# EAGLE design Prototype1 (EAGLE 7.5.0)
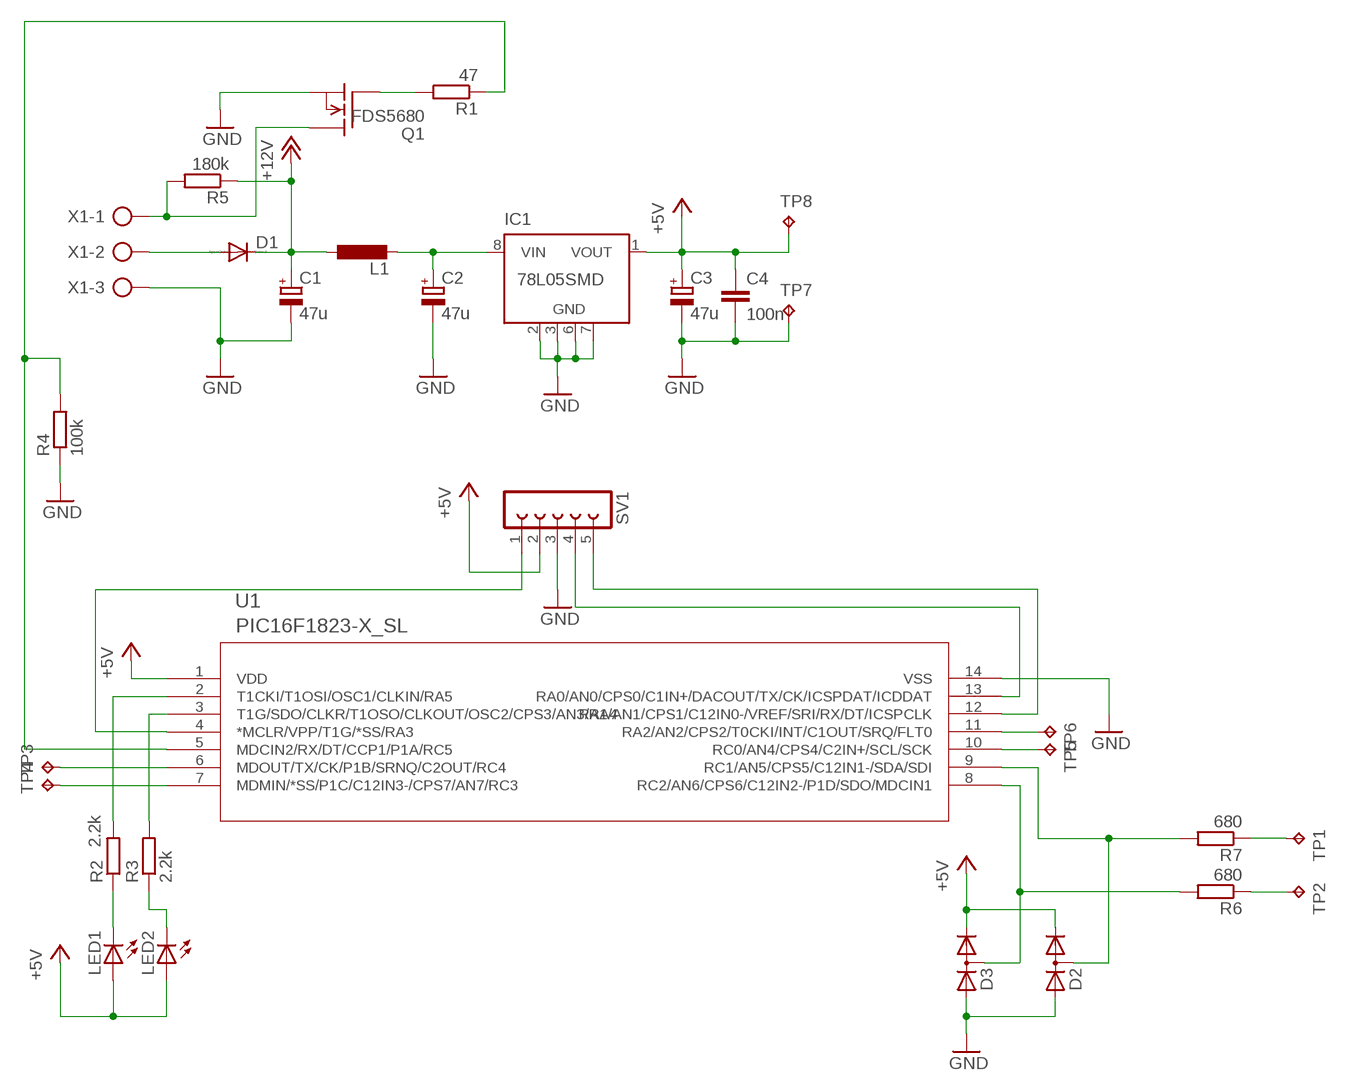
[diagram p0: schematic, sheet 1]

## Parts
C1  47u  CPOL-EU153CLV-0605  [153CLV-0605]
C2  47u  CPOL-EU153CLV-0605  [153CLV-0605]
C3  47u  CPOL-EU153CLV-0605  [153CLV-0605]
C4  100n  C-EUC0805  [C0805]
D1  DIODE-MELF-MLL41  [MELF-MLL41]
D2  DIODE_2CACA-SOT23  [SOT23]
D3  DIODE_2CACA-SOT23  [SOT23]
IC1  78L05SMD  [SO08]
L1  L-EUL3230M  [L3230M]
LED1  LEDSML1206  [SML1206]
LED2  LEDSML1206  [SML1206]
Q1  FDS5680  [SO-8]
R1  47  R-EU_M1206  [M1206]
R2  2.2k  R-EU_M1206  [M1206]
R3  2.2k  R-EU_M1206  [M1206]
R4  100k  R-EU_M1206  [M1206]
R5  180k  R-EU_M1206  [M1206]
R6  680  R-EU_M1206  [M1206]
R7  680  R-EU_M1206  [M1206]
SV1  FE05-1  [FE05-1]
TP1  TPPAD1-13Y  [P1-13Y]
TP2  TPPAD1-13Y  [P1-13Y]
TP3  TPB2,54  [B2,54]
TP4  TPB2,54  [B2,54]
TP5  TPB2,54  [B2,54]
TP6  TPB2,54  [B2,54]
TP7  TPB2,54  [B2,54]
TP8  TPB2,54  [B2,54]
U1  PIC16F1823-X_SL  [SOIC14-N_MC]
X1  AK500/3  [AK500/3]

## Nets
+5V: C3.+ C4.1 D2.2(C) D3.2(C) IC1.1(VOUT) LED1.A LED2.A SV1.2 TP8.TP U1.1(VDD)
+12V: C1.+ D1.C L1.1 R5.1
GND: C1.- C2.- C3.- C4.2 D2.1(A) D3.1(A) IC1.2(GND) IC1.3(GND) IC1.6(GND) IC1.7(GND) Q1.1(S) Q1.2(S) Q1.3(S) R4.1 SV1.3 TP7.TP U1.14(VSS) X1.3
N$1: D1.A X1.2
N$2: C2.+ IC1.8(VIN) L1.2
N$3: Q1.5(D) Q1.6(D) Q1.7(D) Q1.8(D) R5.2 X1.1
N$4: Q1.4(G) R1.2
N$5: D3.3(AC) R6.2 U1.8(RC2/AN6/CPS6/C12IN2-/P1D/SDO/MDCIN1)
N$6: D2.3(AC) R7.2 U1.9(RC1/AN5/CPS5/C12IN1-/SDA/SDI)
N$7: SV1.4 U1.13(RA0/AN0/CPS0/C1IN+/DACOUT/TX/CK/ICSPDAT/ICDDAT)
N$8: SV1.5 U1.12(RA1/AN1/CPS1/C12IN0-/VREF/SRI/RX/DT/ICSPCLK)
N$9: SV1.1 U1.4(*MCLR/VPP/T1G/*SS/RA3)
N$10: R1.1 R4.2 U1.5(MDCIN2/RX/DT/CCP1/P1A/RC5)
N$11: R7.1 TP1.TP
N$12: R6.1 TP2.TP
N$13: LED2.C R3.1
N$14: LED1.C R2.1
N$15: R3.2 U1.3(T1G/SDO/CLKR/T1OSO/CLKOUT/OSC2/CPS3/AN3/RA4)
N$16: R2.2 U1.2(T1CKI/T1OSI/OSC1/CLKIN/RA5)
N$17: TP3.TP U1.6(MDOUT/TX/CK/P1B/SRNQ/C2OUT/RC4)
N$18: TP4.TP U1.7(MDMIN/*SS/P1C/C12IN3-/CPS7/AN7/RC3)
N$19: TP5.TP U1.10(RC0/AN4/CPS4/C2IN+/SCL/SCK)
N$20: TP6.TP U1.11(RA2/AN2/CPS2/T0CKI/INT/C1OUT/SRQ/FLT0)
Unconnected: IC1.4(NC) IC1.5(NC)

## Library data of the parts
C1-C3 = rcl:CPOL-EU: POLARIZED CAPACITOR, European symbol
C4 = rcl:C-EU: CAPACITOR, European symbol
D1 = diode:DIODE-: DIODE
D2 D3 = diode:DIODE_2CACA-: 2 Diodes - Cathode-Anode|Cathode-Anode
IC1 = linear:78L*SMD: Positive VOLTAGE REGULATOR
L1 = rcl:L-EU: INDUCTOR, European symbol
LED1 LED2 = led:LED: LED OSRAM: - CHIPLED LG R971, LG N971, LY N971, LG Q971, LY Q971, LO R971, LY R971 LH N974, LH R974 LS Q976, LO Q976, LY Q976 LO Q996 - Hyper CHIPLED LW Q18S LB Q993, LB Q99A, LB R99A - SideLED LS A670, LO A670, LY A670, LG A670, LP A670 LB A673, LV A673, LT A673, LW A673 LH A674 LY A675 LS A676, LA A676, LO A676, LY A676, LW A676 LS A679, LY A679, LG A679 - Hyper Micro SIDELED® LS Y876, LA Y876, LO Y876, LY Y876 LT Y87S - SmartLED LW L88C, LW L88S LB L89C, LB L89S, LG L890 LS L89K, LO L89K, LY L89K LS L896, LA L896, LO L896, LY L896 - TOPLED LS T670, LO T670, LY T670, LG T670, LP T670 LSG T670, LSP T670, LSY T670, LOP T670, LYG T670 LG T671, LOG T671, LSG T671 LB T673, LV T673, LT T673, LW T673 LH T674 LS T676, LA T676, LO T676, LY T676, LB T676, LH T676, LSB T676, LW T676 LB T67C, LV T67C, LT T67C, LS T67K, LO T67K, LY T67K, LW E67C LS E67B, LA E67B, LO E67B, LY E67B, LB E67C, LV E67C, LT E67C LW T67C LS T679, LY T679, LG T679 LS T770, LO T770, LY T770, LG T770, LP T770 LB T773, LV T773, LT T773, LW T773 LH T774 LS E675, LA E675, LY E675, LS T675 LS T776, LA T776, LO T776, LY T776, LB T776 LHGB T686 LT T68C, LB T68C - Hyper Mini TOPLED® LB M676 - Mini TOPLED Santana® LG M470 LS M47K, LO M47K, LY M47K Source: http://www.osram.convergy.de LUXEON: - LUMILED® LXK2-PW12-R00, LXK2-PW12-S00, LXK2-PW14-U00, LXK2-PW14-V00 LXK2-PM12-R00, LXK2-PM12-S00, LXK2-PM14-U00 LXK2-PE12-Q00, LXK2-PE12-R00, LXK2-PE12-S00, LXK2-PE14-T00, LXK2-PE14-U00 LXK2-PB12-K00, LXK2-PB12-L00, LXK2-PB12-M00, LXK2-PB14-N00, LXK2-PB14-P00, LXK2-PB14-Q00 LXK2-PR12-L00, LXK2-PR12-M00, LXK2-PR14-Q00, LXK2-PR14-R00 LXK2-PD12-Q00, LXK2-PD12-R00, LXK2-PD12-S00 LXK2-PH12-R00, LXK2-PH12-S00 LXK2-PL12-P00, LXK2-PL12-Q00, LXK2-PL12-R00 Source: www.luxeon.com KINGBRIGHT: KA-3528ASYC Source: www.kingbright.com
Q1 = transistor-fet:FDS5680: 60V N-Channel PowerTrench TM MOSFET FAIRCHILD FDS5680.pdf
R1-R7 = rcl:R-EU_: RESISTOR, European symbol
SV1 = con-lsta:FE05-1: FEMALE HEADER; OC_FARNELL: unknown; OC_NEWARK: unknown
TP1-TP8 = testpad:TP: Test pad
U1 = microchip_pic16:PIC16F1823-X_SL
X1 = con-ptr500:AK500/3: CONNECTOR; OC_FARNELL: unknown; OC_NEWARK: unknown

## Board
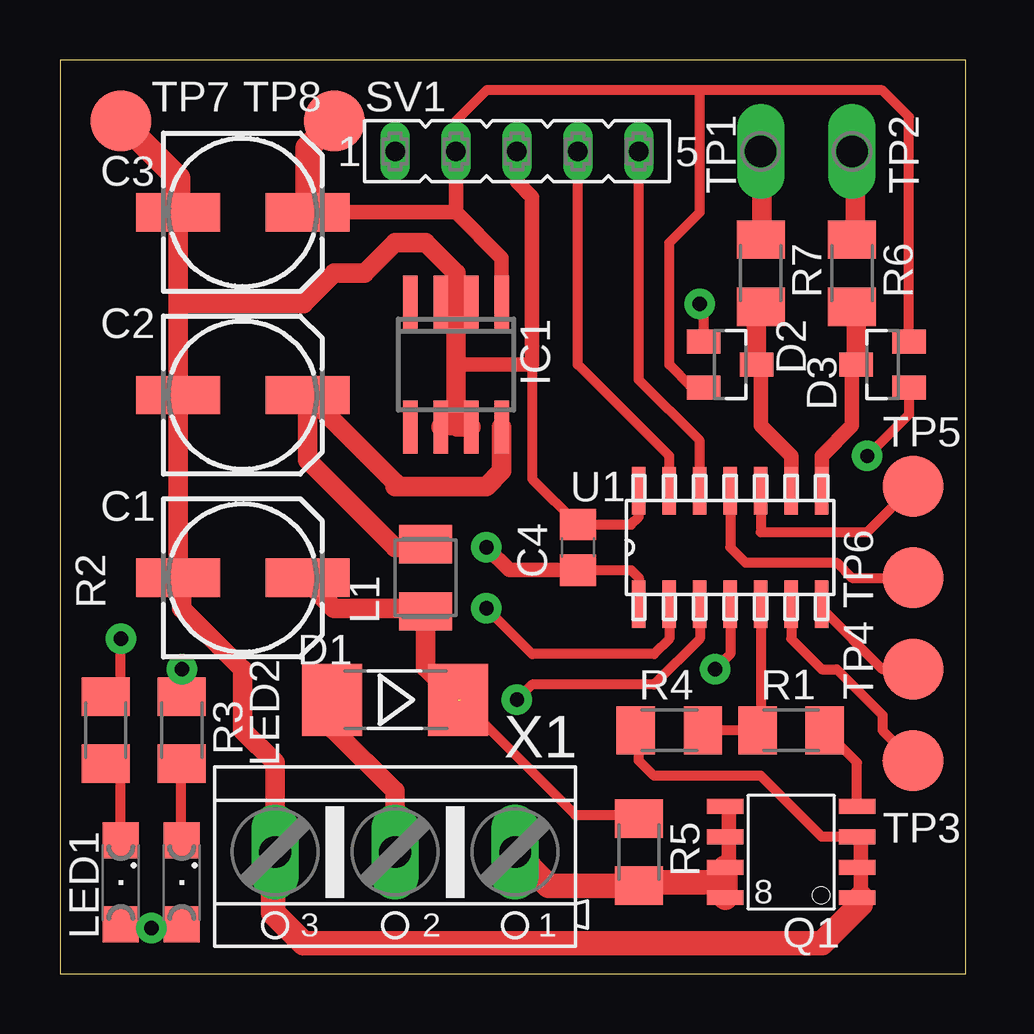
[diagram p1: board, top side]
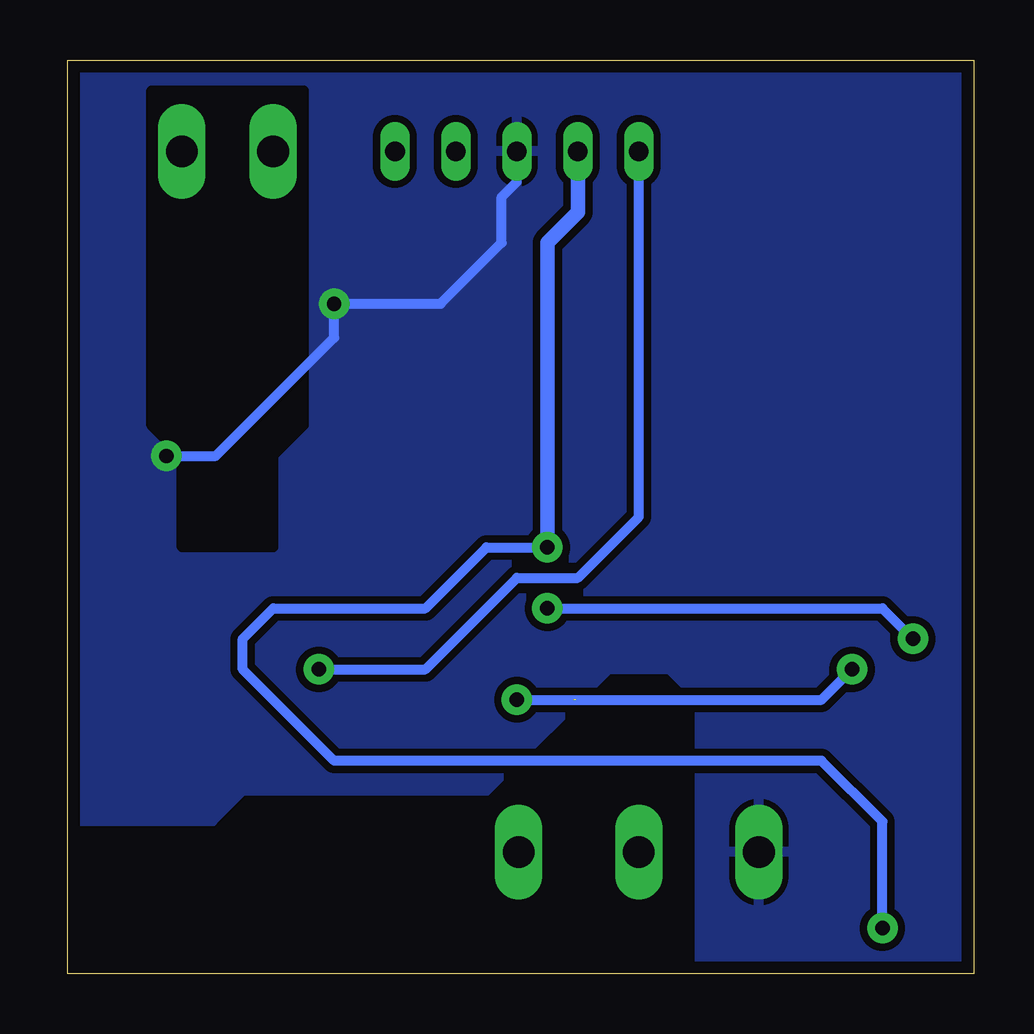
[diagram p2: board, bottom side, seen from below]

Size 37.77 x 38.09 mm. Coordinates in mm from the lower left corner, seen from the top.
Outline: 0,0 37.77,0 37.77,38.09 0,38.09 0,0
Copper layers (1*16): Top 0.035mm / dielectric 1.6mm / Bottom 0.035mm
Design rules "Elecrow_2-layer_PCB_eagle_rule *": minimum track width 6mil, minimum drill 12mil, track to track 12mil, track to pad 12mil, pad to pad 12mil, via to via 12mil, smd to smd 0mil, copper to edge 20mil, drill to drill 10mil, minimum pad ring 6mil, minimum via ring 6mil, stop-mask expansion 0mil, vias tented up to drill 100mil, thermal gap 10mil

### Footprints (pad centres in the part's own frame; a part is rotated, then mirrored left to right if it is on the bottom)
153CLV-0605 = smd 3.5 x 1.6: + 2.7,0; - -2.7,0
C0805 = smd 1.3 x 1.5: 1 -0.95,0; 2 0.95,0
MELF-MLL41 = smd 2.5 x 3: A 2.625,0; C -2.625,0
SOT23 = smd 1 x 1.4: 1 -0.95,-1.1; 2 0.95,-1.1; 3 0,1.1
SO08 = smd 0.6 x 2.2: 1 -1.905,-2.6; 2 -0.635,-2.6; 3 0.635,-2.6; 4 1.905,-2.6; 5 1.905,2.6; 6 0.635,2.6; 7 -0.635,2.6; 8 -1.905,2.6
L3230M = smd 1.6 x 2.2: 1 -1.4,0; 2 1.4,0
SML1206 = smd 1.5 x 1.5: A 1.75,0; C -1.75,0
SO-8 = smd 1.524 x 0.61: 1 -2.743,1.905; 2 -2.743,0.635; 3 -2.743,-0.635; 4 -2.743,-1.905; 5 2.743,-1.905; 6 2.743,-0.635; 7 2.743,0.635; 8 2.743,1.905
M1206 = smd 1.6 x 2: 1 -1.4,0; 2 1.4,0
FE05-1 = drill 0.813 long: 1 -5.08,0; 2 -2.54,0; 3 0,0; 4 2.54,0; 5 5.08,0
P1-13Y = drill 1.321 pad 1.905 long: TP 0,0
B2,54 = smd 2.54 x 2.54: TP 0,0
SOIC14-N_MC = smd 1.981 x 0.559: 1 -2.362,3.81; 2 -2.362,2.54; 3 -2.362,1.27; 4 -2.362,0; 5 -2.362,-1.27; 6 -2.362,-2.54; 7 -2.362,-3.81; 8 2.362,-3.81; 9 2.362,-2.54; 10 2.362,-1.27; 11 2.362,0; 12 2.362,1.27; 13 2.362,2.54; 14 2.362,3.81
AK500/3 = drill 1.321 long: 1 -5.004,0; 2 0,0; 3 5.004,0

### Placement (x,y rotation side)
C1  7.62,16.51 0 top
C2  7.62,24.13 0 top
C3  7.62,31.75 0 top
C4  21.59,17.78 90 top
D1  13.97,11.43 180 top
D2  27.94,25.4 270 top
D3  34.29,25.4 90 top
IC1  16.51,25.4 180 top
L1  15.24,16.51 90 top
LED1  2.54,3.81 270 top
LED2  5.08,3.81 270 top
Q1  30.48,5.08 180 top
R1  30.48,10.16 0 top
R2  1.91,10.16 90 top
R3  5.08,10.16 90 top
R4  25.4,10.16 0 top
R5  24.13,5.08 270 top
R6  33.02,29.21 270 top
R7  29.21,29.21 270 top
SV1  19.05,34.29 0 top
TP1  29.21,34.29 180 top
TP2  33.02,34.29 180 top
TP3  35.56,8.89 0 top
TP4  35.56,12.7 0 top
TP5  35.56,20.32 0 top
TP6  35.56,16.51 0 top
TP7  2.54,35.56 0 top
TP8  11.43,35.56 0 top
U1  27.94,17.78 90 top
X1  13.97,5.08 180 top

### Tracks (layer width: path | path; a pad name or v marks a point on that pad's centre or on a via)
+5V  (via drill 0.6 pad 1.27)
  Top 0.254: 18.29,28.12 IC1.1 | 16.46,34.29 SV1.2 | 24.23,14.63 24.23,15.32 U1.1 | 5.26,2.29 LED2.A | 2.52,2.29 LED1.A
  Top 0.406: C4.1 23.81,16.83 24.13,16.51 U1.1 | D3.2 35.39,35.73 34.29,36.83 26.67,36.83 | 26.67,36.83 17.78,36.83 16.51,35.56 SV1.2 | D2.2 26.35,24.45 25.4,25.4 25.4,30.48 26.67,31.75 26.67,36.83 | 2.52,2.29 2.52,2.52 | LED1.A 3.65,2.06 v3.81,1.91 3.96,2.06 LED2.A
  Top 0.61: C3.+ 16.51,31.75 | 16.51,31.75 18.41,29.84 IC1.1 | SV1.2 16.51,31.75 | C4.1 18.73,16.83 v17.78,17.78
  Top 1.016: TP8.TP 10.32,34.45 C3.+
  Bottom 0.406: v3.81,1.91 3.81,6.35 6.35,8.89 26.67,8.89 30.48,12.7 30.48,13.97 29.21,15.24 22.86,15.24 20.32,17.78 v17.78,17.78
  Bottom 0.61: v17.78,17.78 17.78,30.48 16.51,31.75 SV1.2
+12V  (1 unrouted)
  Top 0.254: 24,6.63 R5.1
  Top 0.406: 24,6.63 21.49,6.63 16.69,11.43
  Top 0.813: D1.C 15.24,12.79 L1.1 15.11,15.24 11.43,15.24 10.32,16.35 C1.+
GND  (via drill 0.6 pad 1.27)
  Top 0.254: IC1.3 16,28.12 16.51,28.12 17.14,28.12 IC1.2 | 33.38,3.2 Q1.1 | 33.38,4.34 Q1.2 33.38,4.57 | 33.38,5.71 Q1.3 | 21.49,18.52 C4.2 | 16,22.86 IC1.6 15.77,22.63 | 17.14,22.86 IC1.7 | 5.03,16.46 C1.-
  Top 0.406: 19.68,25.4 19.68,20.64 C4.2 23.81,18.73 24.13,19.05 U1.14 | Q1.3 31.75,5.71 29.21,8.26 24.77,8.26 24.13,8.89 24.13,10.03 R4.1 | D2.1 26.84,27.77 v26.67,27.94 | D3.1 35.39,23.32 v33.66,21.59
  Top 0.61: 33.38,4.34 33.38,3.2 | 33.38,4.57 33.38,5.71 | SV1.3 19.05,33.02 19.68,32.38 19.68,25.4 16.51,25.4
  Top 0.813: X1.3 8.97,8.81 7.62,10.16 7.62,12.7 5.08,15.24 5.08,16.35 C1.- C2.- 4.92,27.78 | 4.92,27.78 C3.- | 4.92,27.78 5.08,27.94 10.16,27.94 11.43,29.21 12.7,29.21 13.97,30.48 15.24,30.48 16.51,29.21 16.51,28.12 16.51,25.4 16.51,22.86 | 16.51,22.86 15.94,22.86 IC1.6 | IC1.7 16.57,22.8 16.51,22.86
  Top 1.016: 33.38,3.2 33.38,2.9 31.75,1.27 10.16,1.27 8.89,2.54 8.89,5 X1.3 | TP7.TP 4.92,33.18 C3.-
  Bottom 0.254: 9.14,5.03 X1.3 | 19.2,34.29 SV1.3
  Bottom 0.406: SV1.3 19.05,33.02 19.68,32.38 19.68,30.48 22.23,27.94 v26.67,27.94 26.67,26.52 31.6,21.59 v33.66,21.59
  pour Bottom: 38.1,6.35 38.1,38.1 0,38.1 0,0 11.43,0 11.43,11.43 12.7,12.7 15.24,12.7 20.32,7.62 30.48,7.62 31.75,6.35
N$1
  Top 0.813: X1.2 13.97,7.62 11.43,10.16 11.43,11.35 D1.A
N$2
  Top 0.813: L1.2 15.11,17.78 13.97,17.78 10.32,21.43 C2.+ 13.97,20.48 13.97,20.32 17.78,20.32 18.41,20.95 IC1.8
N$3
  Top 0.254: 27.89,6.86 Q1.5 | 27.89,4.57 Q1.7 | 27.89,5.71 Q1.6
  Top 0.61: 27.89,6.86 27.89,5.71 27.89,4.57
  Top 1.016: X1.1 20.37,3.68 R5.2 24.26,3.81 27.74,3.81 | Q1.8 27.74,3.81 | 27.74,3.81 Q1.7
N$4
  Top 0.406: Q1.4 33.22,8.82 R1.2
N$5
  Top 0.254: 33.15,27.66 R6.2
  Top 0.406: 33.02,25.23 D3.3 | 33.19,27.64 R6.2
  Top 0.61: U1.8 31.75,21.59 33.02,22.86 33.02,25.23
  Top 0.813: D3.3 33.19,27.64
N$6
  Top 0.406: 29.21,25.23 D2.3 | 29.04,27.64 R7.2
  Top 0.61: U1.9 30.48,21.59 29.21,22.86 29.21,25.23
  Top 0.813: D2.3 29.04,27.64
N$7
  Top 0.406: U1.13 25.4,21.59 21.59,25.4 SV1.4
N$8
  Top 0.406: U1.12 26.67,22.23 24.13,24.77 SV1.5
N$9  (via drill 0.6 pad 1.27)
  Top 0.406: U1.4 27.94,13.34 v27.3,12.7
  Bottom 0.406: v27.3,12.7 22.86,12.7 19.05,16.51 16.51,16.51 13.97,19.05 SV1.1
N$10
  Top 0.406: U1.5 29.21,10.16 R1.1 R4.2
N$11
  Top 0.254: 29.26,30.63 R7.1 | 29.26,34.29 TP1.TP
  Top 0.813: 29.26,34.29 29.26,30.63
N$12
  Top 0.254: 33.15,30.63 R6.1 | 33.15,34.29 TP2.TP
  Top 0.813: 33.15,34.29 33.15,30.63
N$13
  Top 0.254: 5.03,5.71 LED2.C | 5.03,8.69 R3.1
  Top 0.406: 5.03,8.69 5.03,5.71
N$14
  Top 0.254: 2.52,5.71 LED1.C | 2.52,8.69 R2.1
  Top 0.406: 2.52,8.69 2.52,5.71
N$15  (via drill 0.6 pad 1.27)
  Top 0.406: U1.3 26.67,13.97 24.77,12.06 19.68,12.06 v19.05,11.43 | v5.08,12.7 R3.2
  Bottom 0.406: v19.05,11.43 6.35,11.43 v5.08,12.7
N$16  (via drill 0.6 pad 1.27)
  Top 0.406: U1.2 25.4,13.97 24.77,13.34 19.68,13.34 v17.78,15.24 | R2.2 2.54,12.2 v2.54,13.97
  Bottom 0.406: v17.78,15.24 3.81,15.24 v2.54,13.97
N$17
  Top 0.406: U1.6 30.48,13.97 31.75,12.7 32.38,12.7 34.29,10.79 34.29,10.16 TP3.TP
N$18
  Top 0.406: TP4.TP 34.29,12.7 31.75,15.24 U1.7
N$19
  Top 0.406: U1.10 29.21,18.41 33.66,18.41 TP5.TP
N$20
  Top 0.406: U1.11 27.94,17.78 28.57,17.14 32.38,17.14 33.02,16.51 TP6.TP
N$21
  cutout Bottom: 29.21,20.32 29.21,17.78 33.02,17.78 33.02,21.59 34.29,22.86 34.29,36.83 27.94,36.83 27.94,22.86 29.21,21.59